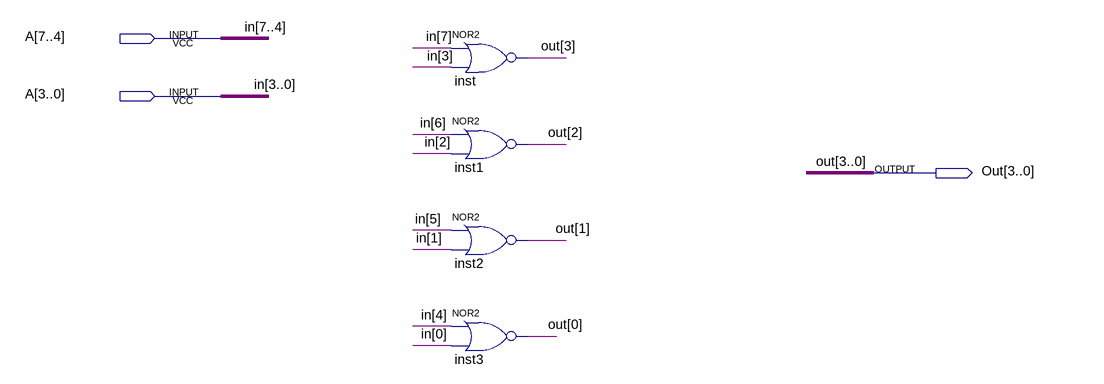
[diagram p0: schematic sheet]
// Quartus schematic bigNor.bdf as structural Verilog: 4 symbols, 3 pins
module bigNor (
  input  [7:0] A,
  output [3:0] Out
);

  nor inst (Out[3], A[7], A[3]);
  nor inst1 (Out[2], A[6], A[2]);
  nor inst2 (Out[1], A[5], A[1]);
  nor inst3 (Out[0], A[4], A[0]);

  // Other names for the same wires on the sheet: in[7:0] = A
endmodule
